# EAGLE design wifi-adapter (EAGLE 7.7.0)
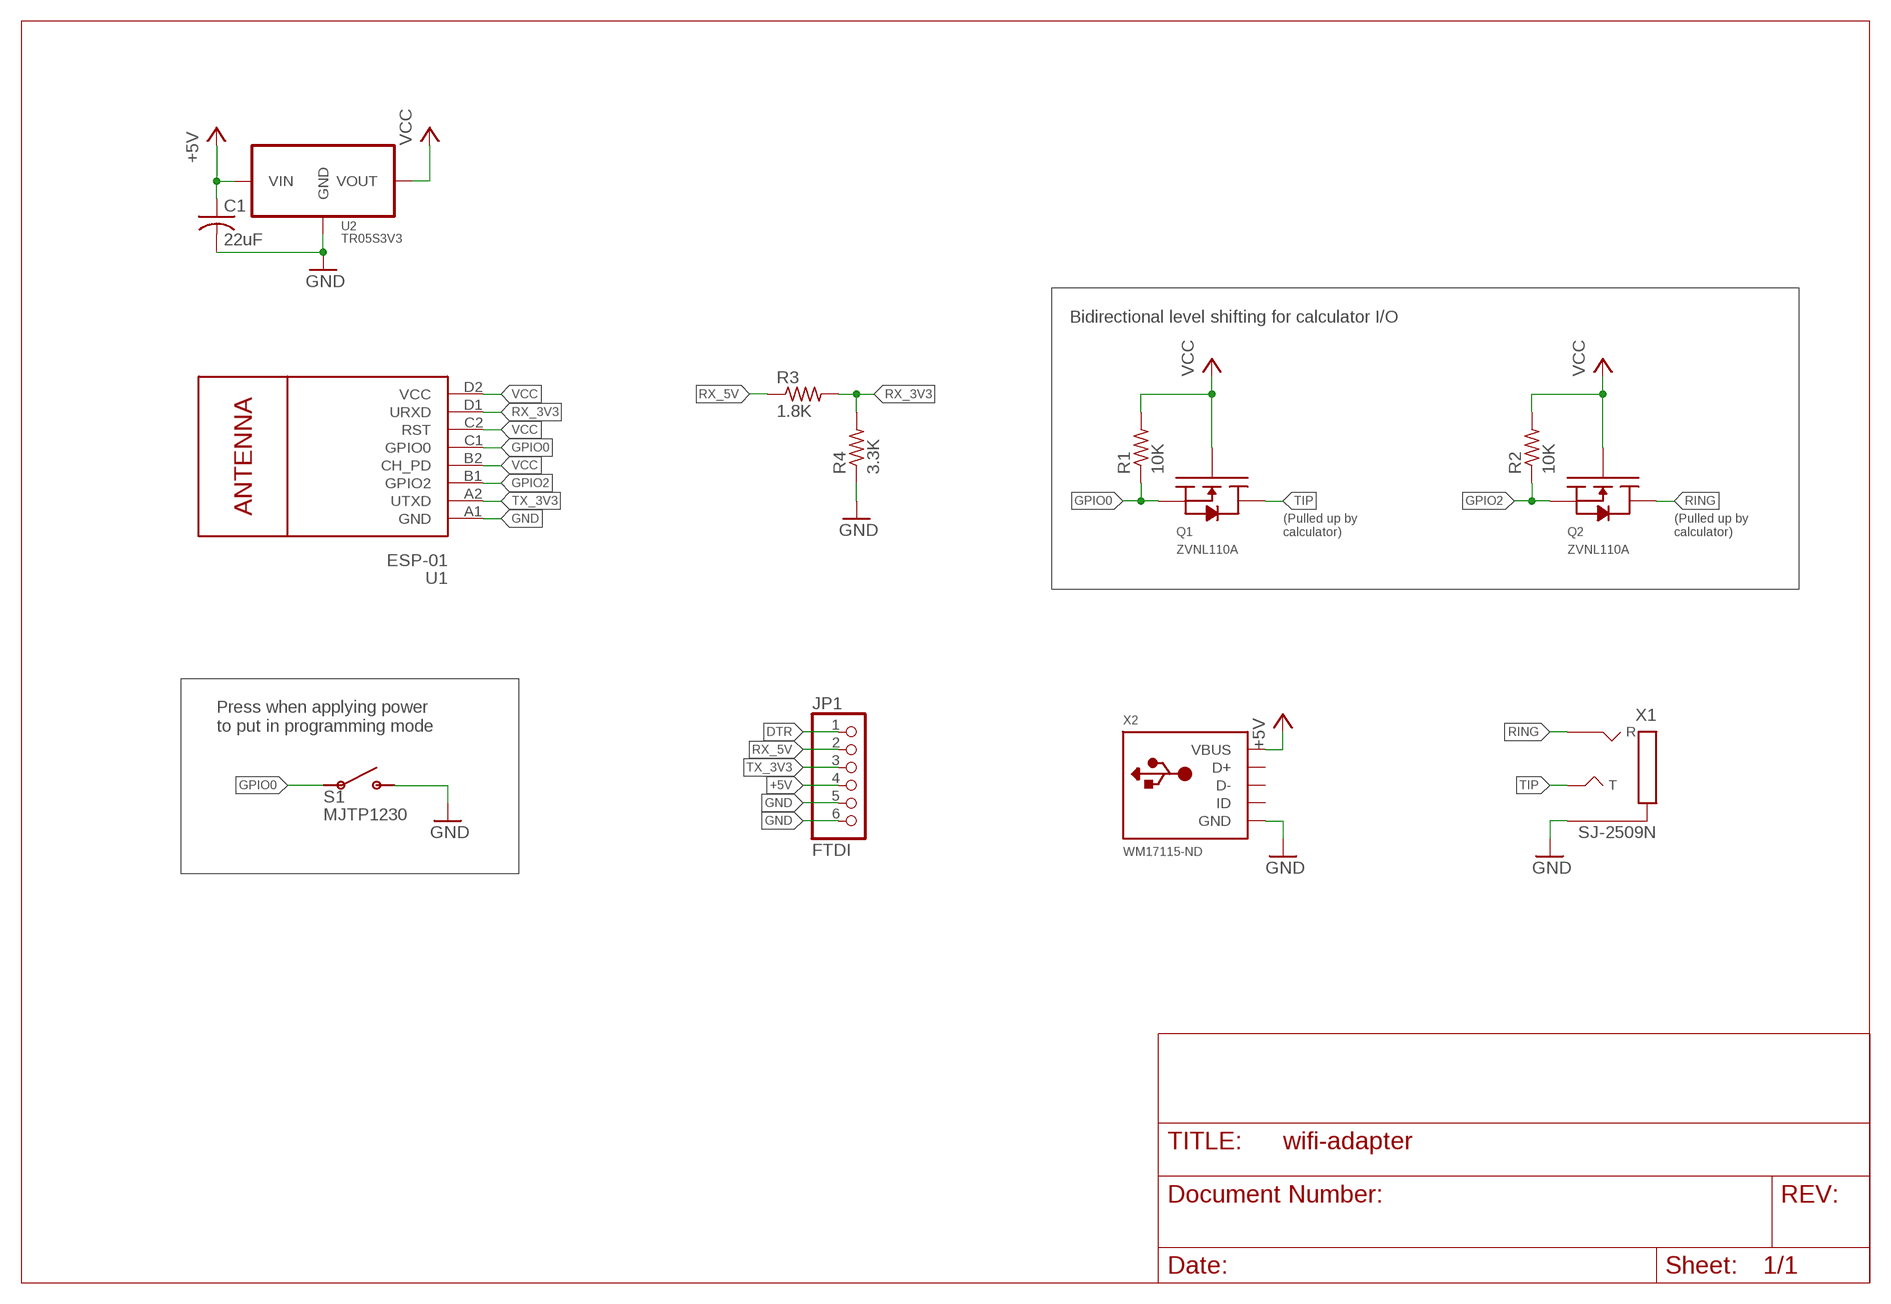
[diagram p0: schematic, sheet 1]

## Parts
C1  22uF  C-US025-025X050  [C025-025X050]
JP1  FTDI  PINHD-1X6  [1X06]
Q1  ZVNL110A  ZVNL110ARIGHTANGLE  [E-LINE-RA]
Q2  ZVNL110A  ZVNL110ARIGHTANGLE  [E-LINE-RA]
R1  10K  R-US_0207/10  [0207/10]
R2  10K  R-US_0207/10  [0207/10]
R3  1.8K  R-US_0207/10  [0207/10]
R4  3.3K  R-US_0207/10  [0207/10]
S1  MJTP1230  TACTILE-BUTTON-MJTP1230  [TACTILE-BUTTON-MJTP1230]
U1  ESP-01  WIRELESS-WIFI-ESP-01  [WIRELESS-WIFI-ESP-01]
U2  TR05S3V3  TR05SXX  [3-SIP]
X1  SJ-2509N  [SJ-2509N]
X2  WM17115-ND  USB-MINI-B  [USB-MINI-B]

## Nets
+5V: C1.1 JP1.4 U2.P$1(VIN) X2.VBUS
DTR: JP1.1
GND: C1.2 JP1.5 JP1.6 R4.1 S1.P$2 S1.P$4 U1.A1(GND) U2.P$2(GND) X1.P$1 X2.GND X2.GND1(GND) X2.GND4(GND)
GPIO0: Q1.P$3(S) R1.1 S1.P$1 S1.P$3 U1.C1(GPIO0)
GPIO2: Q2.P$3(S) R2.1 U1.B1(GPIO2)
RING: Q2.P$1(D) X1.P$2
RX_3V3: R3.2 R4.2 U1.D1(URXD)
RX_5V: JP1.2 R3.1
TIP: Q1.P$1(D) X1.P$3
TX_3V3: JP1.3 U1.A2(UTXD)
VCC: Q1.P$2(G) Q2.P$2(G) R1.2 R2.2 U1.B2(CH_PD) U1.C2(RST) U1.D2(VCC) U2.P$3(VOUT)
Unconnected: X2.D+ X2.D- X2.ID

## Notes on the sheet
- Bidirectional level shifting for calculator I/O
- (Pulled up by
  calculator)
- (Pulled up by
  calculator)
- Press when applying power
  to put in programming mode

## Library data of the parts
C1 = rcl:C-US: CAPACITOR, American symbol
JP1 = pinhead:PINHD-1X6: PIN HEADER
Q1 Q2 = my-custom:ZVNL110A: MOSFET N-CH 100V 320MA TO92-3
R1-R4 = rcl:R-US_: RESISTOR, American symbol
S1 = my-custom:TACTILE-BUTTON-MJTP1230
U1 = diy-modules:WIRELESS-WIFI-ESP-01: Wireless Wi-Fi ESP-01 Module based on ESP8266 chip
U2 = my-custom:TR05SXX: XP Power TR series DC-DC converter
X1 = my-custom:SJ-2509N: CONN JACK STEREO 2.5MM R/A
X2 = my-custom:USB-MINI-B: USB Connectors USBMINIB - Surface Mount Female Mini-B USB Connector 4UConnector: 06564 By microbuilder.eu Thru-hole RA Female Mini-B USB Connector 4UConnector: 18732 By ladyada.net

## Board
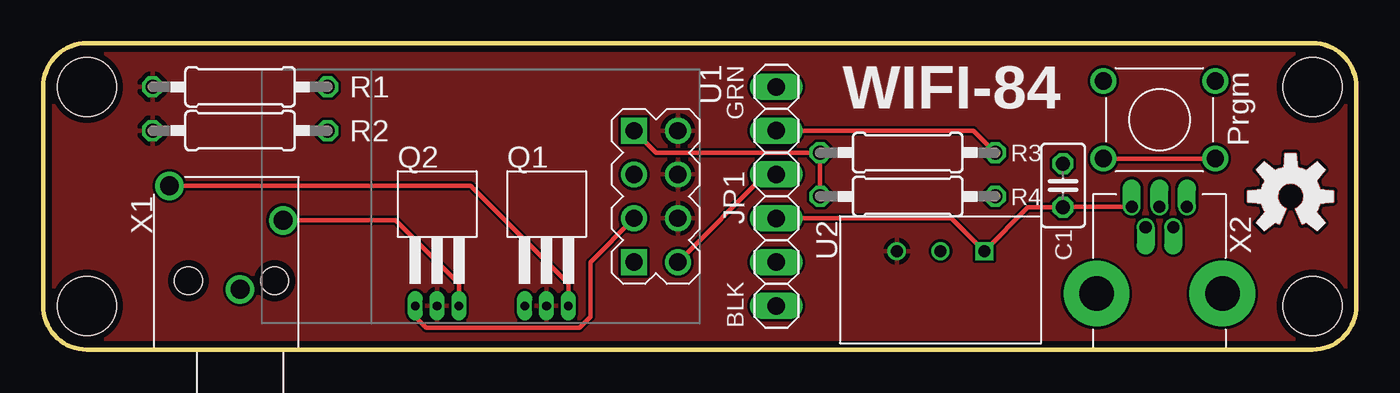
[diagram p1: board, top side]
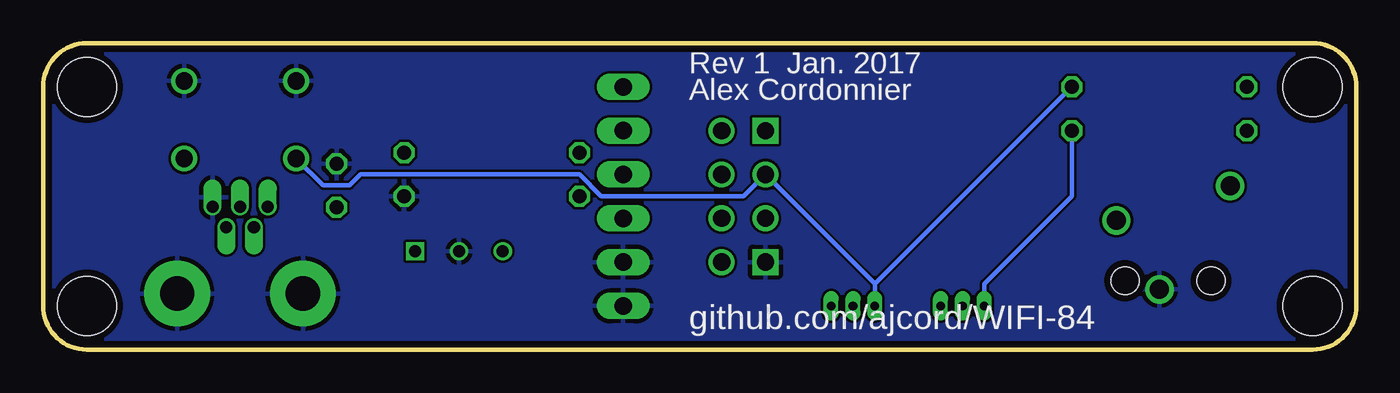
[diagram p2: board, bottom side, seen from below]

Size 76.2 x 17.78 mm. Coordinates in mm from the lower left corner, seen from the top.
Outline: 0,15.23 0,2.54 arc90 2.54,0 73.66,0 arc90 76.2,2.54 76.2,15.24 arc90 73.66,17.78 2.54,17.78 arc90 0,15.24
Copper layers (1*16): Top 0.0356mm / dielectric 1.5011mm / Bottom 0.0356mm
Design rules "OSHPark": minimum track width 6mil, minimum drill 13mil, track to track 6mil, track to pad 6mil, pad to pad 6mil, via to via 6mil, smd to smd 6mil, copper to edge 15mil, drill to drill 6mil, minimum pad ring 7mil, minimum via ring 7mil, stop-mask expansion 3mil, vias tented up to drill 0mil, thermal gap 10mil
Holes 3.4 mm at 2.54,15.24 2.54,2.54 73.66,2.54 73.66,15.24

### Footprints (pad centres in the part's own frame; a part is rotated, then mirrored left to right if it is on the bottom)
C025-025X050 = drill 0.813 octagon: 1 -1.27,0; 2 1.27,0
1X06 = drill 1.016 long: 1 -6.35,0; 2 -3.81,0; 3 -1.27,0; 4 1.27,0; 5 3.81,0; 6 6.35,0
E-LINE-RA = drill 0.5 long: P$1 1.27,0; P$2 0,0; P$3 -1.27,0
0207/10 = drill 0.813 octagon: 1 -5.08,0; 2 5.08,0
TACTILE-BUTTON-MJTP1230 = drill 1: P$1 -3.25,2.25; P$2 -3.25,-2.25; P$3 3.25,2.25; P$4 3.25,-2.25
WIRELESS-WIFI-ESP-01 = drill 1 square: A1 -8.89,3.81; D1 -8.89,-3.81 | drill 1: A2 -11.43,3.81; B1 -8.89,1.27; B2 -11.43,1.27; C1 -8.89,-1.27; C2 -11.43,-1.27; D2 -11.43,-3.81
3-SIP = drill 0.7 square: P$1 2.54,0 | drill 0.7: P$2 0,0; P$3 -2.54,0
SJ-2509N = drill 1.1: P$1 0,3.5; P$2 2.5,7.5; P$3 -4.1,9.5 | hole 1.6: -3,4; 2,4
USB-MINI-B = drill 0.7 offset: D+ 0,5.125; D- -0.8,3.925; GND 1.6,5.125; ID 0.8,3.925; VBUS -1.6,5.125 | drill 2 pad 3.81: GND1 -3.65,0.075; GND4 3.65,0.075

### Placement (x,y rotation side)
C1  59.18,9.53 90 top
JP1  42.55,8.89 270 top
Q1  29.21,2.54 0 top
Q2  22.86,2.54 0 top
R1  11.43,15.24 180 top
R2  11.43,12.7 180 top
R3  50.16,11.43 180 top
R4  50.16,8.89 180 top
S1  64.77,13.34 180 top
U1  25.4,8.89 180 top
U2  52.07,5.71 0 top
U$1  [OSHW-LOGO-M]  72.39,8.89 0 top
U$2  [OSHW-LOGO-M_COPPER]  72.39,8.89 0 top
X1  11.43,0 0 top
X2  64.77,3.17 0 top

### Tracks (layer width: path | path; a pad name or v marks a point on that pad's centre or on a via)
+5V
  Top 0.254: JP1.4 52.7,7.62 U2.P$1 57.15,8.26 C1.1 59.23,8.3 X2.VBUS
GND
  pour Bottom: 0,17.78 76.2,17.78 76.2,0 0,0
GPIO0
  Top 0.254: S1.P$3 S1.P$1
  Bottom 0.254: S1.P$3 59.96,9.53 58.42,9.53 57.78,10.16 45.09,10.16 43.81,8.89 35.56,8.89 U1.C1 27.94,3.81 | R1.1 27.94,3.81 | 27.94,3.81 Q1.P$3
GPIO2
  Top 0.254: U1.B1 31.75,5.08 31.75,1.91 31.11,1.27 22.23,1.27 21.59,1.91 Q2.P$3
  Bottom 0.254: R2.1 16.51,8.89 21.59,3.81 Q2.P$3
RING
  Top 0.254: X1.P$2 20.44,7.5 24.13,3.81 Q2.P$1
RX_3V3
  Top 0.254: R4.2 R3.2 35.56,11.43 U1.D1
RX_5V
  Top 0.254: JP1.2 53.98,12.7 R3.1
TIP
  Top 0.254: X1.P$3 24.79,9.5 30.48,3.81 Q1.P$1
TX_3V3
  Top 0.254: U1.A2 41.91,10.16 JP1.3
VCC
  pour Top: 0,17.78 76.2,17.78 76.2,0 0,0

### Text on the board
tPlace: GRN | WIFI-84 | Prgm | BLK
bPlace: Rev 1 Jan. 2017 / Alex Cordonnier | github.com/ajcord/WIFI-84